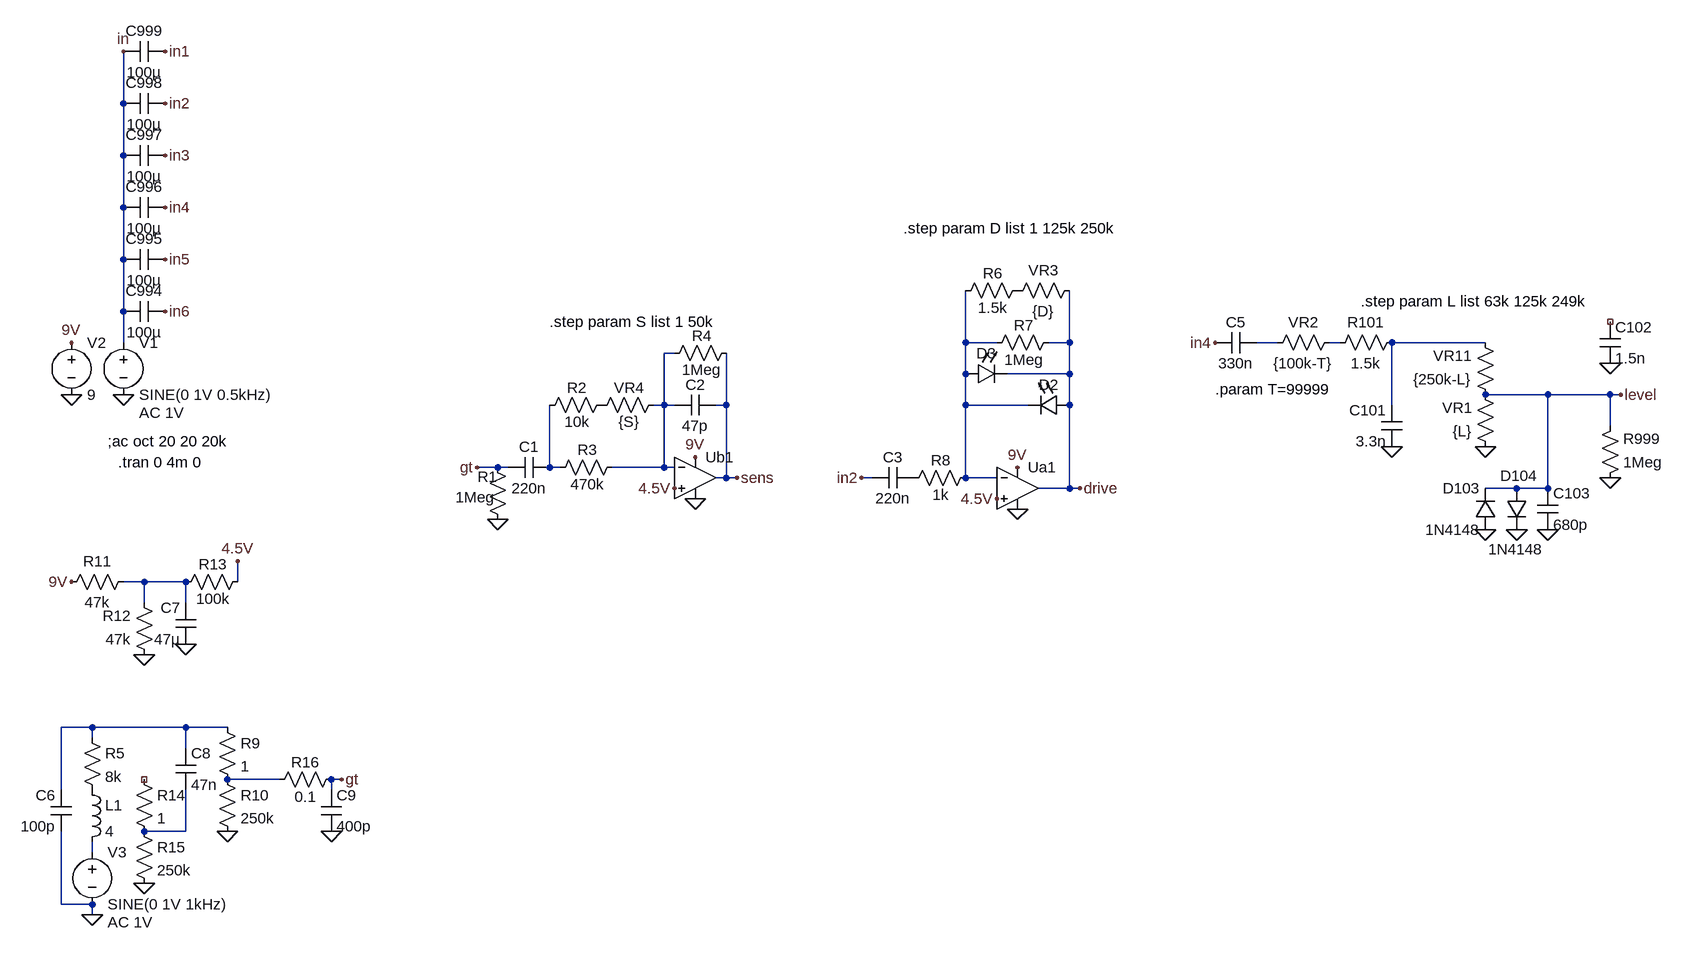
[diagram p0: schematic hdm5.asc]
hdm5.asc, the LTspice schematic file:
Version 4
SHEET 1 3148 3460
WIRE -1568 704 -1568 624
WIRE -1568 784 -1568 704
WIRE -1568 864 -1568 784
WIRE -1568 944 -1568 864
WIRE -1568 1024 -1568 944
WIRE -1568 1072 -1568 1024
WIRE -272 1072 -272 992
WIRE -224 1072 -272 1072
WIRE -112 1072 -112 992
WIRE -112 1072 -144 1072
WIRE 208 1072 176 1072
WIRE 304 1072 288 1072
WIRE 528 1072 384 1072
WIRE -720 1088 -736 1088
WIRE -272 1120 -272 1072
WIRE -112 1120 -112 1072
WIRE -112 1120 -208 1120
WIRE 624 1152 528 1152
WIRE 720 1152 624 1152
WIRE 736 1152 720 1152
WIRE -736 1168 -736 1088
WIRE -736 1168 -752 1168
WIRE -720 1168 -736 1168
WIRE -640 1168 -640 1088
WIRE -640 1168 -656 1168
WIRE -272 1168 -272 1120
WIRE -176 1168 -272 1168
WIRE -112 1168 -112 1120
WIRE 384 1168 384 1072
WIRE 720 1200 720 1152
WIRE -992 1264 -1024 1264
WIRE -976 1264 -992 1264
WIRE -912 1264 -912 1168
WIRE -896 1264 -912 1264
WIRE -736 1264 -736 1168
WIRE -736 1264 -816 1264
WIRE -720 1264 -736 1264
WIRE -640 1280 -640 1168
WIRE -640 1280 -656 1280
WIRE -624 1280 -640 1280
WIRE -416 1280 -432 1280
WIRE -272 1280 -272 1168
WIRE -224 1280 -272 1280
WIRE -112 1296 -112 1168
WIRE -112 1296 -160 1296
WIRE -96 1296 -112 1296
WIRE 576 1296 528 1296
WIRE 624 1296 624 1152
WIRE 624 1296 576 1296
WIRE -1536 1440 -1568 1440
WIRE -1472 1440 -1536 1440
WIRE -1392 1440 -1392 1408
WIRE -1536 1472 -1536 1440
WIRE -1472 1472 -1472 1440
WIRE -1616 1664 -1664 1664
WIRE -1472 1664 -1616 1664
WIRE -1408 1664 -1472 1664
WIRE -1616 1680 -1616 1664
WIRE -1472 1696 -1472 1664
WIRE -1328 1744 -1408 1744
WIRE -1232 1744 -1248 1744
WIRE -1664 1760 -1664 1664
WIRE -1248 1760 -1248 1744
WIRE -1472 1824 -1472 1760
WIRE -1472 1824 -1536 1824
WIRE -1616 1856 -1616 1840
WIRE -1664 1936 -1664 1824
WIRE -1616 1936 -1664 1936
WIRE -1616 1952 -1616 1936
FLAG -1568 1152 0
FLAG -1568 624 in
FLAG -1648 1152 0
FLAG -1648 1072 9V
FLAG -1504 624 in1
FLAG -1504 704 in2
FLAG -1504 784 in3
FLAG -1504 864 in4
FLAG -1504 944 in5
FLAG -1504 1024 in6
FLAG -688 1248 9V
FLAG -688 1312 0
FLAG -992 1344 0
FLAG -1472 1536 0
FLAG -1536 1552 0
FLAG -1648 1440 9V
FLAG 384 1232 0
FLAG 528 1232 0
FLAG 720 1280 0
FLAG -1024 1264 gt
FLAG 112 1072 in4
FLAG 720 1104 0
FLAG 528 1360 0
FLAG 624 1360 0
FLAG 576 1360 0
FLAG 736 1152 level
FLAG -1392 1408 4.5V
FLAG -720 1296 4.5V
FLAG -624 1280 sens
FLAG -192 1264 9V
FLAG -192 1328 0
FLAG -432 1280 in2
FLAG -224 1312 4.5V
FLAG -96 1296 drive
FLAG -1616 1952 0
FLAG -1408 1824 0
FLAG -1536 1904 0
FLAG -1248 1824 0
FLAG -1232 1744 gt
SYMBOL voltage -1568 1056 R0
WINDOW 123 24 124 Left 2
WINDOW 39 0 0 Left 2
SYMATTR Value2 AC 1V
SYMATTR InstName V1
SYMATTR Value SINE(0 1V 0.5kHz)
SYMBOL voltage -1648 1056 R0
WINDOW 123 0 0 Left 0
WINDOW 39 0 0 Left 0
SYMATTR InstName V2
SYMATTR Value 9
SYMBOL Opamps\\UniversalOpamp2 -688 1280 R0
SYMATTR InstName Ub1
SYMBOL cap -1504 688 R90
WINDOW 0 0 32 VBottom 2
WINDOW 3 32 32 VTop 2
SYMATTR InstName C998
SYMATTR Value 100µ
SYMBOL cap -1504 768 R90
WINDOW 0 0 32 VBottom 2
WINDOW 3 32 32 VTop 2
SYMATTR InstName C997
SYMATTR Value 100µ
SYMBOL cap -1504 848 R90
WINDOW 0 0 32 VBottom 2
WINDOW 3 32 32 VTop 2
SYMATTR InstName C996
SYMATTR Value 100µ
SYMBOL cap -1504 608 R90
WINDOW 0 0 32 VBottom 2
WINDOW 3 32 32 VTop 2
SYMATTR InstName C999
SYMATTR Value 100µ
SYMBOL cap -1504 928 R90
WINDOW 0 0 32 VBottom 2
WINDOW 3 32 32 VTop 2
SYMATTR InstName C995
SYMATTR Value 100µ
SYMBOL cap -1504 1008 R90
WINDOW 0 0 32 VBottom 2
WINDOW 3 32 32 VTop 2
SYMATTR InstName C994
SYMATTR Value 100µ
SYMBOL cap -912 1248 R90
WINDOW 0 0 32 VBottom 2
WINDOW 3 32 32 VTop 2
SYMATTR InstName C1
SYMATTR Value 220n
SYMBOL cap 176 1056 R90
WINDOW 0 0 32 VBottom 2
WINDOW 3 32 32 VTop 2
SYMATTR InstName C5
SYMATTR Value 330n
SYMBOL cap 400 1232 R180
WINDOW 0 24 56 Left 2
WINDOW 3 24 8 Left 2
SYMATTR InstName C101
SYMATTR Value 3.3n
SYMBOL cap -656 1152 R90
WINDOW 0 0 32 VBottom 2
WINDOW 3 32 32 VTop 2
SYMATTR InstName C2
SYMATTR Value 47p
SYMBOL cap -1456 1536 R180
WINDOW 0 24 56 Left 2
WINDOW 3 24 8 Left 2
SYMATTR InstName C7
SYMATTR Value 47µ
SYMBOL res -976 1360 R180
WINDOW 0 16 82 Left 2
WINDOW 3 20 50 Left 2
SYMATTR InstName R1
SYMATTR Value 1Meg
SYMBOL res -816 1152 R90
WINDOW 0 -11 54 VCenter 2
WINDOW 3 42 54 VCenter 2
SYMATTR InstName R2
SYMATTR Value 10k
SYMBOL res 704 1296 M180
WINDOW 0 36 76 Left 2
WINDOW 3 36 40 Left 2
SYMATTR InstName R999
SYMATTR Value 1Meg
SYMBOL res -1552 1424 R90
WINDOW 0 0 56 VBottom 2
WINDOW 3 32 56 VTop 2
SYMATTR InstName R11
SYMATTR Value 47k
SYMBOL res -1520 1568 R180
WINDOW 0 36 76 Left 2
WINDOW 3 36 40 Left 2
SYMATTR InstName R12
SYMATTR Value 47k
SYMBOL res -96 976 R90
WINDOW 0 0 56 VBottom 2
WINDOW 3 32 56 VTop 2
SYMATTR InstName VR3
SYMATTR Value {D}
SYMBOL res 304 1056 R90
WINDOW 0 0 56 VBottom 2
WINDOW 3 32 56 VTop 2
SYMATTR InstName VR2
SYMATTR Value {100k-T}
SYMBOL res 400 1056 R90
WINDOW 0 0 56 VBottom 2
WINDOW 3 32 56 VTop 2
SYMATTR InstName R101
SYMATTR Value 1.5k
SYMBOL res 544 1248 R180
WINDOW 0 36 76 Left 2
WINDOW 3 36 40 Left 2
SYMATTR InstName VR1
SYMATTR Value {L}
SYMBOL res 544 1168 R180
WINDOW 0 36 76 Left 2
WINDOW 3 36 40 Left 2
SYMATTR InstName VR11
SYMATTR Value {250k-L}
SYMBOL cap 704 1040 R0
SYMATTR InstName C102
SYMATTR Value 1.5n
SYMBOL diode 560 1296 R0
WINDOW 0 -9 -19 Left 2
WINDOW 3 -28 94 Left 2
SYMATTR InstName D104
SYMATTR Value 1N4148
SYMBOL diode 544 1360 R180
WINDOW 0 24 64 Left 2
WINDOW 3 24 0 Left 2
SYMATTR InstName D103
SYMATTR Value 1N4148
SYMBOL cap 608 1296 R0
SYMATTR InstName C103
SYMATTR Value 680p
SYMBOL res -800 1248 R90
WINDOW 0 -11 54 VCenter 2
WINDOW 3 42 54 VCenter 2
SYMATTR InstName R3
SYMATTR Value 470k
SYMBOL res -736 1152 R90
WINDOW 0 -11 54 VCenter 2
WINDOW 3 42 54 VCenter 2
SYMATTR InstName VR4
SYMATTR Value {S}
SYMBOL res -1376 1424 R90
WINDOW 0 -11 54 VCenter 2
WINDOW 3 42 54 VCenter 2
SYMATTR InstName R13
SYMATTR Value 100k
SYMBOL res -624 1072 R90
WINDOW 0 -11 54 VCenter 2
WINDOW 3 42 54 VCenter 2
SYMATTR InstName R4
SYMATTR Value 1Meg
SYMBOL Opamps\\UniversalOpamp2 -192 1296 R0
SYMATTR InstName Ua1
SYMBOL cap -352 1264 R90
WINDOW 0 0 32 VBottom 2
WINDOW 3 32 32 VTop 2
SYMATTR InstName C3
SYMATTR Value 220n
SYMBOL res -256 1264 R90
WINDOW 0 -11 54 VCenter 2
WINDOW 3 42 54 VCenter 2
SYMATTR InstName R8
SYMATTR Value 1k
SYMBOL LED -112 1152 R90
WINDOW 0 0 32 VBottom 2
WINDOW 3 72 32 Invisible 2
SYMATTR InstName D2
SYMBOL LED -272 1104 M90
WINDOW 0 0 32 VBottom 2
WINDOW 3 72 32 Invisible 2
SYMATTR InstName D3
SYMBOL res -176 976 R90
WINDOW 0 -11 54 VCenter 2
WINDOW 3 42 54 VCenter 2
SYMATTR InstName R6
SYMATTR Value 1.5k
SYMBOL cap -1648 1824 R180
WINDOW 0 24 56 Left 2
WINDOW 3 24 8 Left 2
SYMATTR InstName C6
SYMATTR Value 100p
SYMBOL voltage -1616 1840 R0
WINDOW 123 24 124 Left 2
WINDOW 39 0 0 Left 2
SYMATTR Value2 AC 1V
SYMATTR InstName V3
SYMATTR Value SINE(0 1V 1kHz)
SYMBOL res -1632 1664 R0
SYMATTR InstName R5
SYMATTR Value 8k
SYMBOL ind -1632 1744 R0
SYMATTR InstName L1
SYMATTR Value 4
SYMBOL cap -1488 1696 R0
SYMATTR InstName C8
SYMATTR Value 47n
SYMBOL res -1424 1648 R0
SYMATTR InstName R9
SYMATTR Value 1
SYMBOL res -1424 1728 R0
SYMATTR InstName R10
SYMATTR Value 250k
SYMBOL res -1552 1728 R0
SYMATTR InstName R14
SYMATTR Value 1
SYMBOL res -1552 1808 R0
SYMATTR InstName R15
SYMATTR Value 250k
SYMBOL cap -1264 1760 R0
SYMATTR InstName C9
SYMATTR Value 400p
SYMBOL res -1232 1728 R90
WINDOW 0 5 56 VBottom 2
WINDOW 3 27 56 VTop 2
SYMATTR InstName R16
SYMATTR Value 0.1
SYMBOL res -128 1056 R90
WINDOW 0 -11 54 VCenter 2
WINDOW 3 42 54 VCenter 2
SYMATTR InstName R7
SYMATTR Value 1Meg
TEXT -1592 1224 Left 2 !;ac oct 20 20 20k
TEXT -1576 1256 Left 2 !.tran 0 4m 0
TEXT -368 896 Left 2 !.step param D list 1 125k 250k
TEXT 336 1008 Left 2 !.step param L list 63k 125k 249k
TEXT 112 1144 Left 2 !.param T=99999
TEXT -912 1040 Left 2 !.step param S list 1 50k

The netlist it stands for:
* hdm5.asc
V1 in 0 SINE(0 1V 0.5kHz) AC 1V
V2 9V 0 9
XUb1 4.5V N005 9V 0 sens level.2 Avol=1Meg GBW=10Meg Slew=10Meg ilimit=25m rail=0 Vos=0 phimargin=45 en=0 enk=0 in=0 ink=0 Rin=500Meg  ; pins IN+ IN- V+ V- OUT
C998 in2 in 100µ
C997 in3 in 100µ
C996 in4 in 100µ
C999 in1 in 100µ
C995 in5 in 100µ
C994 in6 in 100µ
C1 N006 gt 220n
C5 N002 in4 330n
C101 0 N004 3.3n
C2 sens N005 47p
C7 0 N007 47µ
R1 0 gt 1Meg
R2 P001 N006 10k
R999 0 level 1Meg
R11 N007 9V 47k
R12 0 N007 47k
R§VR3 drive P002 {D}
R§VR2 N003 N002 {100k-T}
R101 N004 N003 1.5k
R§VR1 0 level {L}
R§VR11 level N004 {250k-L}
C102 NC_01 0 1.5n
D104 level 0 1N4148
D103 0 level 1N4148
C103 level 0 680p
R3 N005 N006 470k
R§VR4 N005 P001 {S}
R13 4.5V N007 100k
R4 sens N005 1Meg
XUa1 4.5V N001 9V 0 drive level.2 Avol=1Meg GBW=10Meg Slew=10Meg ilimit=25m rail=0 Vos=0 phimargin=45 en=0 enk=0 in=0 ink=0 Rin=500Meg  ; pins IN+ IN- V+ V- OUT
C3 P003 in2 220n
R8 N001 P003 1k
D2 drive N001 D
D3 N001 drive D
R6 P002 N001 1.5k
C6 0 N008 100p
V3 N011 0 SINE(0 1V 1kHz) AC 1V
R5 N008 P004 8k
L1 P004 N011 4
C8 N008 N010 47n
R9 N008 N009 1
R10 N009 0 250k
R14 NC_02 N010 1
R15 N010 0 250k
C9 gt 0 400p
R16 gt N009 0.1
R7 drive N001 1Meg
.model D D
.lib standard.dio
;ac oct 20 20 20k
.tran 0 4m 0
.step param D list 1 125k 250k
.step param L list 63k 125k 249k
.param T=99999
.step param S list 1 50k
.lib UniversalOpamps2.sub
.backanno
.end